# Altium project JDB-001.PrjPcb
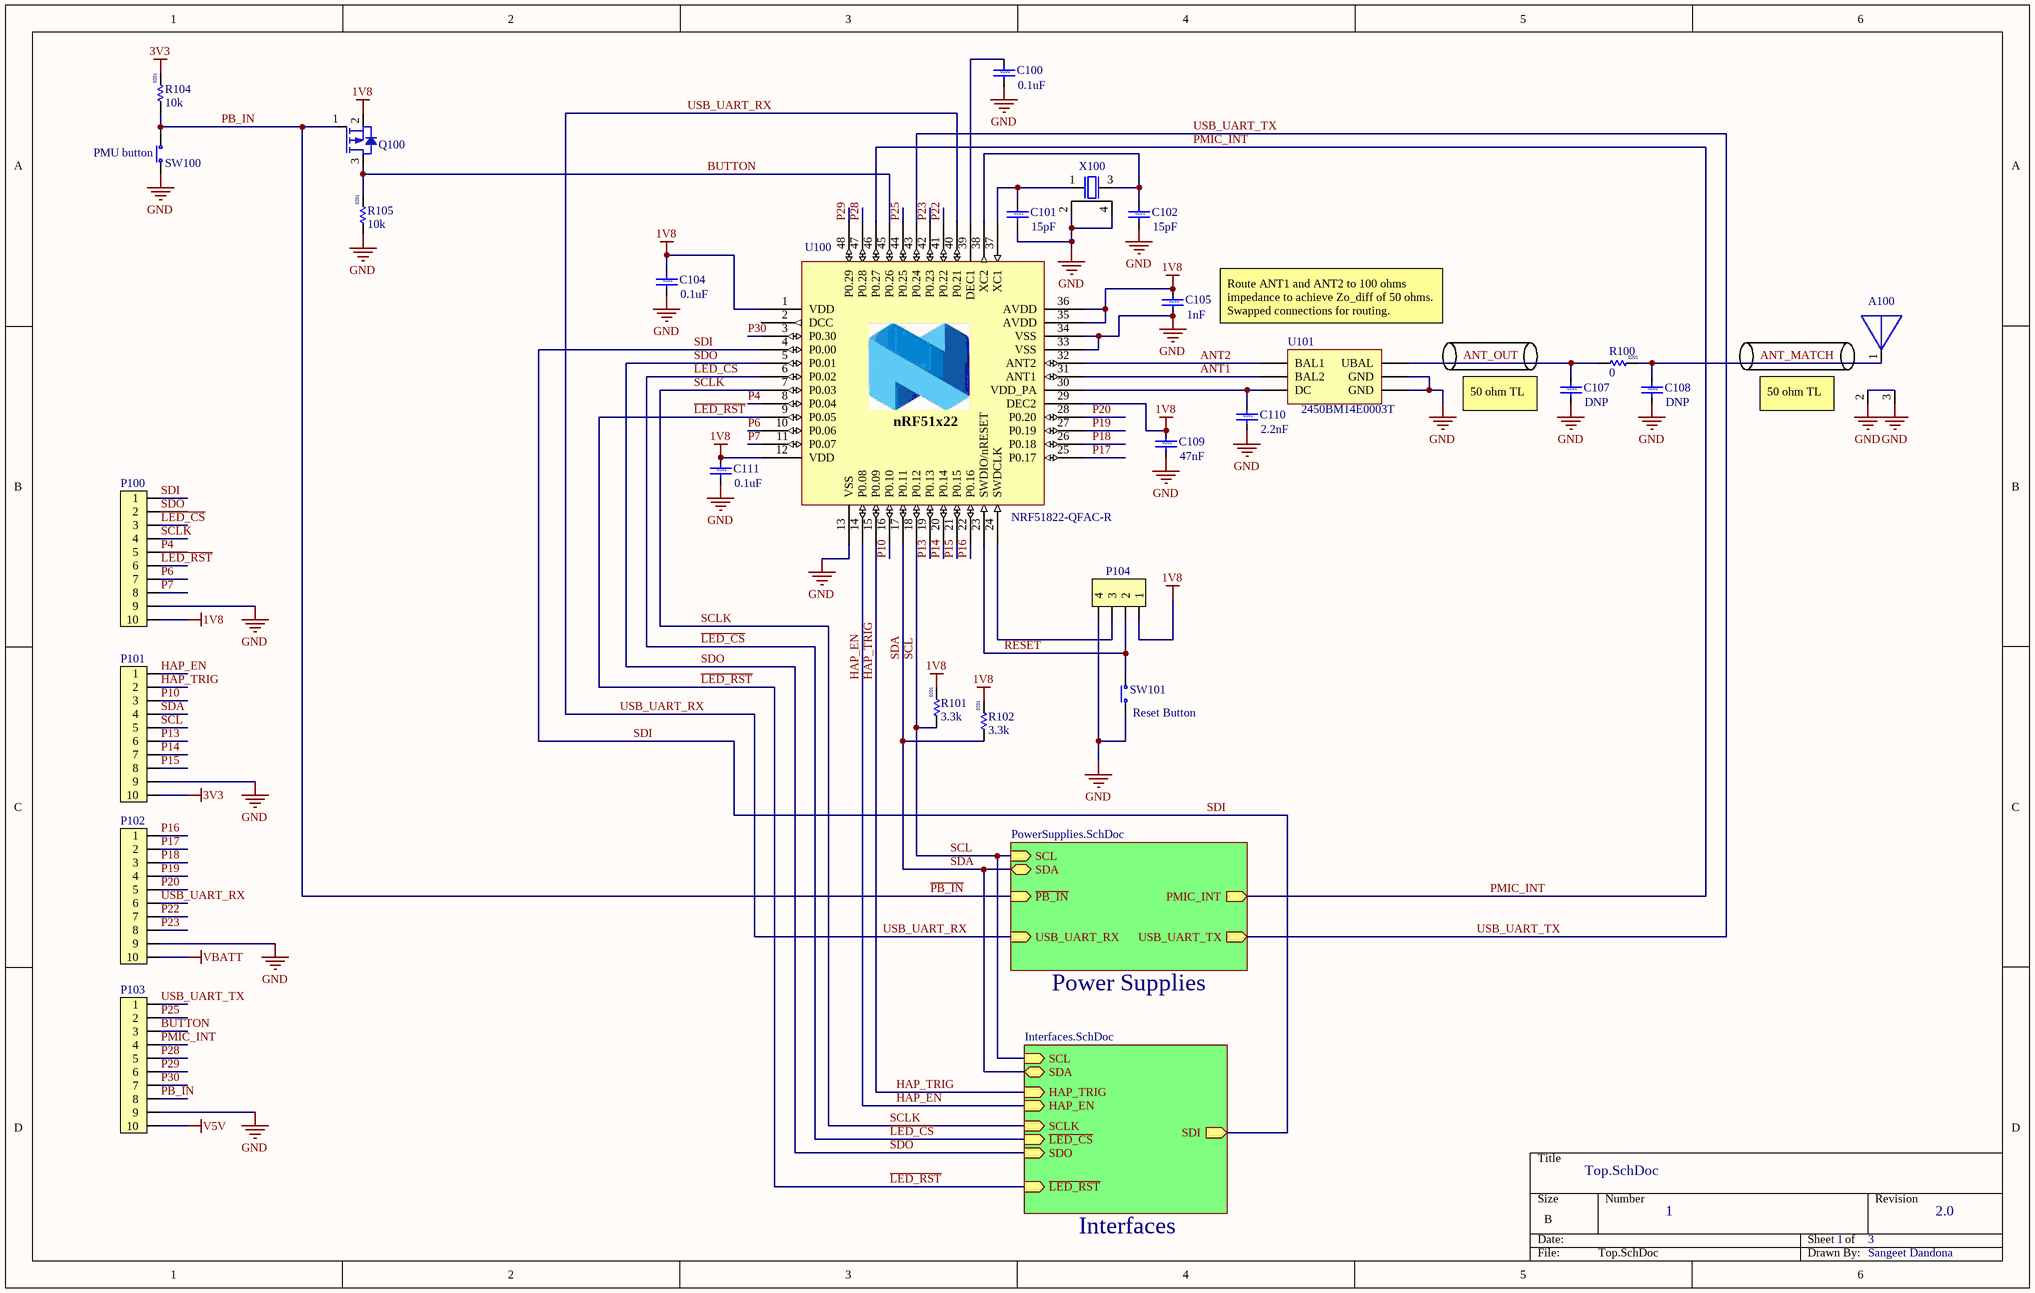
[diagram p0: Top.SchDoc]
3 sheets, 89 parts. Net scope: hierarchical (ports join the sheet entries above them; power ports are global).
Board file: JDB-001.PcbDoc
Sheets:
  Top.SchDoc
    Interfaces = Interfaces.SchDoc
    Power Supplies = PowerSupplies.SchDoc

## Sheet Top.SchDoc
size B; DocumentNumber: 1; SheetNumber: 1; SheetTotal: 3

### Parts
A100  (no value)  [2450AT07A0100]
C100  value 0.1uF  Size: 0201  [Cap 0201 HD]
C101  value 15pF  Size: 0201  [Cap 0201 HD]
C102  value 15pF  Size: 0201  [Cap 0201 HD]
C104  value 0.1uF  Size: 0201  [Cap 0201 HD]
C105  value 1nF  Size: 0201  [Cap 0201 HD]
C107  value DNP  Size: 0201  [Cap 0201 HD]
C108  value DNP  Size: 0201  [Cap 0201 HD]
C109  value 47nF  Size: 0201  [Cap 0201 HD]
C110  value 2.2nF  Size: 0201  [Cap 0201 HD]
C111  value 0.1uF  Size: 0201  [Cap 0201 HD]
P100  (no value)  [Molex 15-91-2100]
P101  (no value)  [Molex 15-91-2100]
P102  (no value)  [Molex 15-91-2100]
P103  (no value)  [Molex 15-91-2100]
P104  (no value)  [4-CONN_MOLEX]
Q100  (no value)  [SOT-723]
R100  value 0  Size: 0201  [RES 0201 HD]
R101  value 3.3k  Size: 0201  [RES 0201 HD]
R102  value 3.3k  Size: 0201  [RES 0201 HD]
R104  value 10k  Size: 0201  [RES 0201 HD]
R105  value 10k  Size: 0201  [RES 0201 HD]
SW100  (no value)  [ALPS_SKHUxxx010_WO_GND]
SW101  (no value)  [ALPS_SKHUxxx010_WO_GND]
U100  NRF51822-QFAC-R  [QFN40P600X600X90-48N]
U101  MFPN: 2450BM14E0003T  [2450BM14E0003]  (hidden comment: nRF51822 Balun RF filter)
X100  (no value)  [XTAL_ABM11-16]

### Sub-sheets
Interfaces = Interfaces.SchDoc: SDA (bidir), SCL (in), SDO (in), ~{LED_CS} (in), ~{LED_RST} (in), SCLK (in), HAP_EN (in), HAP_TRIG (in), SDI (out)
Power Supplies = PowerSupplies.SchDoc: SCL (in), SDA (bidir), PMIC_INT (out), ~{PB_IN} (in), USB_UART_RX (in), USB_UART_TX (out)

### Nets
1V8: C104.1 C105.1 C109.1 C111.1 P100.10 P104.1 Q100.2(S) R101.2 R102.2 U100.1(VDD) U100.12(VDD) U100.29(DEC2) U100.35(AVDD) U100.36(AVDD)
3V3: P101.10 R104.2
GND: A100.2 A100.3 C100.2 C101.2 C102.2 C104.2 C105.2 C107.2 C108.2 C109.2 C110.2 C111.2 P100.9 P101.9 P102.9 P103.9 P104.4 R105.1 SW100.2(COM) SW101.2(COM) U100.13(VSS) U100.33(VSS) U100.34(VSS) U100.49 U101.2(GND) U101.6(GND) X100.2 X100.4
V5V: P103.10
VBATT: P102.10
~{LED_CS}: P100.3 U100.6(P0.02) ; sheet Interfaces/~{LED_CS}
~{LED_RST}: P100.6 U100.9(P0.05) ; sheet Interfaces/~{LED_RST}
~{PB_IN}: P103.8 Q100.1(G) R104.1 SW100.1(N.O) ; sheet Power Supplies/~{PB_IN}  [also labelled PB_IN]
~{RESET}: P104.2 SW101.1(N.O) U100.23(SWDIO/nRESET)
ANT1: U100.31(ANT1) U101.4(BAL2)
ANT2: U100.32(ANT2) U101.3(BAL1)
ANT_MATCH: A100.1 C108.1 R100.2
ANT_OUT: C107.1 R100.1 U101.1(UBAL)
BUTTON: P103.3 Q100.3(D) R105.2 U100.45(P0.26)
HAP_EN: P101.1 U100.14(P0.08) ; sheet Interfaces/HAP_EN
HAP_TRIG: P101.2 U100.15(P0.09) ; sheet Interfaces/HAP_TRIG
P4: P100.5 U100.8(P0.04)
P6: P100.7 U100.10(P0.06)
P7: P100.8 U100.11(P0.07)
P10: P101.3 U100.16(P0.10)
P13: P101.6 U100.19(P0.13)
P14: P101.7 U100.20(P0.14)
P15: P101.8 U100.21(P0.15)
P16: P102.1 U100.22(P0.16)
P17: P102.2 U100.25(P0.17)
P18: P102.3 U100.26(P0.18)
P19: P102.4 U100.27(P0.19)
P20: P102.5 U100.28(P0.20)
P22: P102.7 U100.41(P0.22)
P23: P102.8 U100.42(P0.23)
P25: P103.2 U100.44(P0.25)
P28: P103.5 U100.47(P0.28)
P29: P103.6 U100.48(P0.29)
P30: P103.7 U100.3(P0.30)
PMIC_INT: P103.4 U100.46(P0.27) ; sheet Power Supplies/PMIC_INT
SCL: P101.5 R101.1 U100.18(P0.12) ; sheet Interfaces/SCL, sheet Power Supplies/SCL
SCLK: P100.4 U100.7(P0.03) ; sheet Interfaces/SCLK
SDA: P101.4 R102.1 U100.17(P0.11) ; sheet Interfaces/SDA, sheet Power Supplies/SDA
SDI: P100.1 U100.4(P0.00) ; sheet Interfaces/SDI
SDO: P100.2 U100.5(P0.01) ; sheet Interfaces/SDO
USB_UART_RX: P102.6 U100.40(P0.21) ; sheet Power Supplies/USB_UART_RX
USB_UART_TX: P103.1 U100.43(P0.24) ; sheet Power Supplies/USB_UART_TX
NetC100_1: C100.1 U100.39(DEC1)
NetC101_1: C101.1 U100.37(XC1) X100.1
NetC102_1: C102.1 U100.38(XC2) X100.3
NetC110_1: C110.1 U100.30(VDD_PA) U101.5(DC)
NetP104_3: P104.3 U100.24(SWDCLK)

Not connected (* = marked no-connect by the designer): U100 2(DCC)

### Notes on the sheet
- (near SW100) PMU button
- Route ANT1 and ANT2 to 100 ohms impedance to achieve Zo_diff of 50 ohms. Swapped connections for routing.
- (near C107) 50 ohm TL
- (near A100) 50 ohm TL
- (near SW101) Reset Button
- 2.0
- Sangeet Dandona
- (in symbol nRF51x22_QFAx) nRF51x22

### Library data of the parts
A100 = 2450AT07A0100: ANTENNA SMD EIA 0402 2.4GHZ; MF: Johanson Technology Inc.; MFPN: 2450AT07A0100E; Size: 1mmx0.5mm; Height: 0.37mm; Cost: 0.36562
C100 C104 C111 = Cap 0201 0.1uF 6.3V: CAP CER 0.1UF 6.3V 10% X5R 0201; MF: Murata Electronics North America; MFPN: GRM033R60J104KE19D; Cost: 0.00780
C101 C102 = Cap 0201 11pF 25V: CAP CER 15PF 25V NP0 0201; MF: Murata Electronics North America; MFPN: GRM0335C1E150FA01D; Cost: 0.00900
C105 = Cap 0201 1nF 25V: CAP CER 1000PF 25V 10% X7R 0201; MF: Murata Electronics North America; MFPN: GRM033R71E102KA01D; Cost: 0.00600
C107 C108 = Cap 0201 Generic: Capacitor, Ceramic 0201, DNP; Cost: 0; MF: N/A; MFPN: DNP
C109 = Cap 0201 47nF 10V: CAP CER 0.047UF 10V 10% X5R 0201; MF: Taiyo Yuden; MFPN: LMK063BJ473KP-F; Cost: 0.03000
C110 = Cap 0201 2.2nF 16V: CAP CER 2200PF 16V 10% X7R 0201; MF: Murata Electronics North America; MFPN: GRM033R71C222KA88D; Cost: 0.00630
P100-P103 = CONN-10: CONN HEADER 10POS .100" VERT TIN; MF: Molex, LLC; MFPN: 0015912100; Cost: 0.47152
P104 = CONN-4_MOLEX: CONN HEADER 4POS VERT 2.54MM SMD; MF: Molex, LLC; MFPN: 0878980426; Cost: 0.25300
Q100 = MOSFET-P: MOSFET P-CH 20V 0.1A VMT3; MF: Rohm Semiconductor; MFPN: RZM001P02T2L; Size: 1.2mm x 0.8mm; Package: SOT-723; Cost: 0.22000; Type: MOSFET-P
R100 = Res 0201 0R Jumper: RES SMD 0.0OHM JUMPER 1/20W 0201; MF: Samsung Electro-Mechanics America, Inc.; MFPN: RC0603J000CS; Cost: 0.00787
R101 R102 = Res 0201 3.3k 5%: RES SMD 3.3K OHM 5% 1/20W 0201; MF: Samsung Electro-Mechanics America, Inc.; MFPN: RC0603J332CS; Cost: 0.00648
R104 R105 = Res 0201 10k 5%: RES SMD 10K OHM 5% 1/20W 0201; MF: Rohm Semiconductor; MFPN: MCR006YRTJ103; Cost: 0.00828
SW100 SW101 = SW-PB: Tactile Switches 6.0x6.0x2.5mm 160gf; MF: ALPS; MFPN: SKHUALE010; Cost: 0.201; Size: 6.3mm x 6.2mm x 3.1mm
U100 = nRF51x22_QFAx: IC SOC 2.4GHZ 256K FLASH 48QFN; MF: Nordic Semiconductor ASA; Cost: 2.33310; MFPN: NRF51822-QFAC-R
U101 = nRF51822 Balun RF filter: NORDIC NRF51 BALUN FILTER; MF: Johanson Technology Inc.; Cost: 0.66000
X100 = XTAL_ABM11-16: CRYSTAL 16.0000MHZ 10PF SMD; MF: Abracon LLC; MFPN: ABM11-16.000MHZ-B7G-T; Size: 2.0mm x 1.6mm; Cost: 0.60000

## Sheet Interfaces.SchDoc
size B; DocumentNumber: 2; Revision: 3.0; SheetNumber: 2; SheetTotal: 3
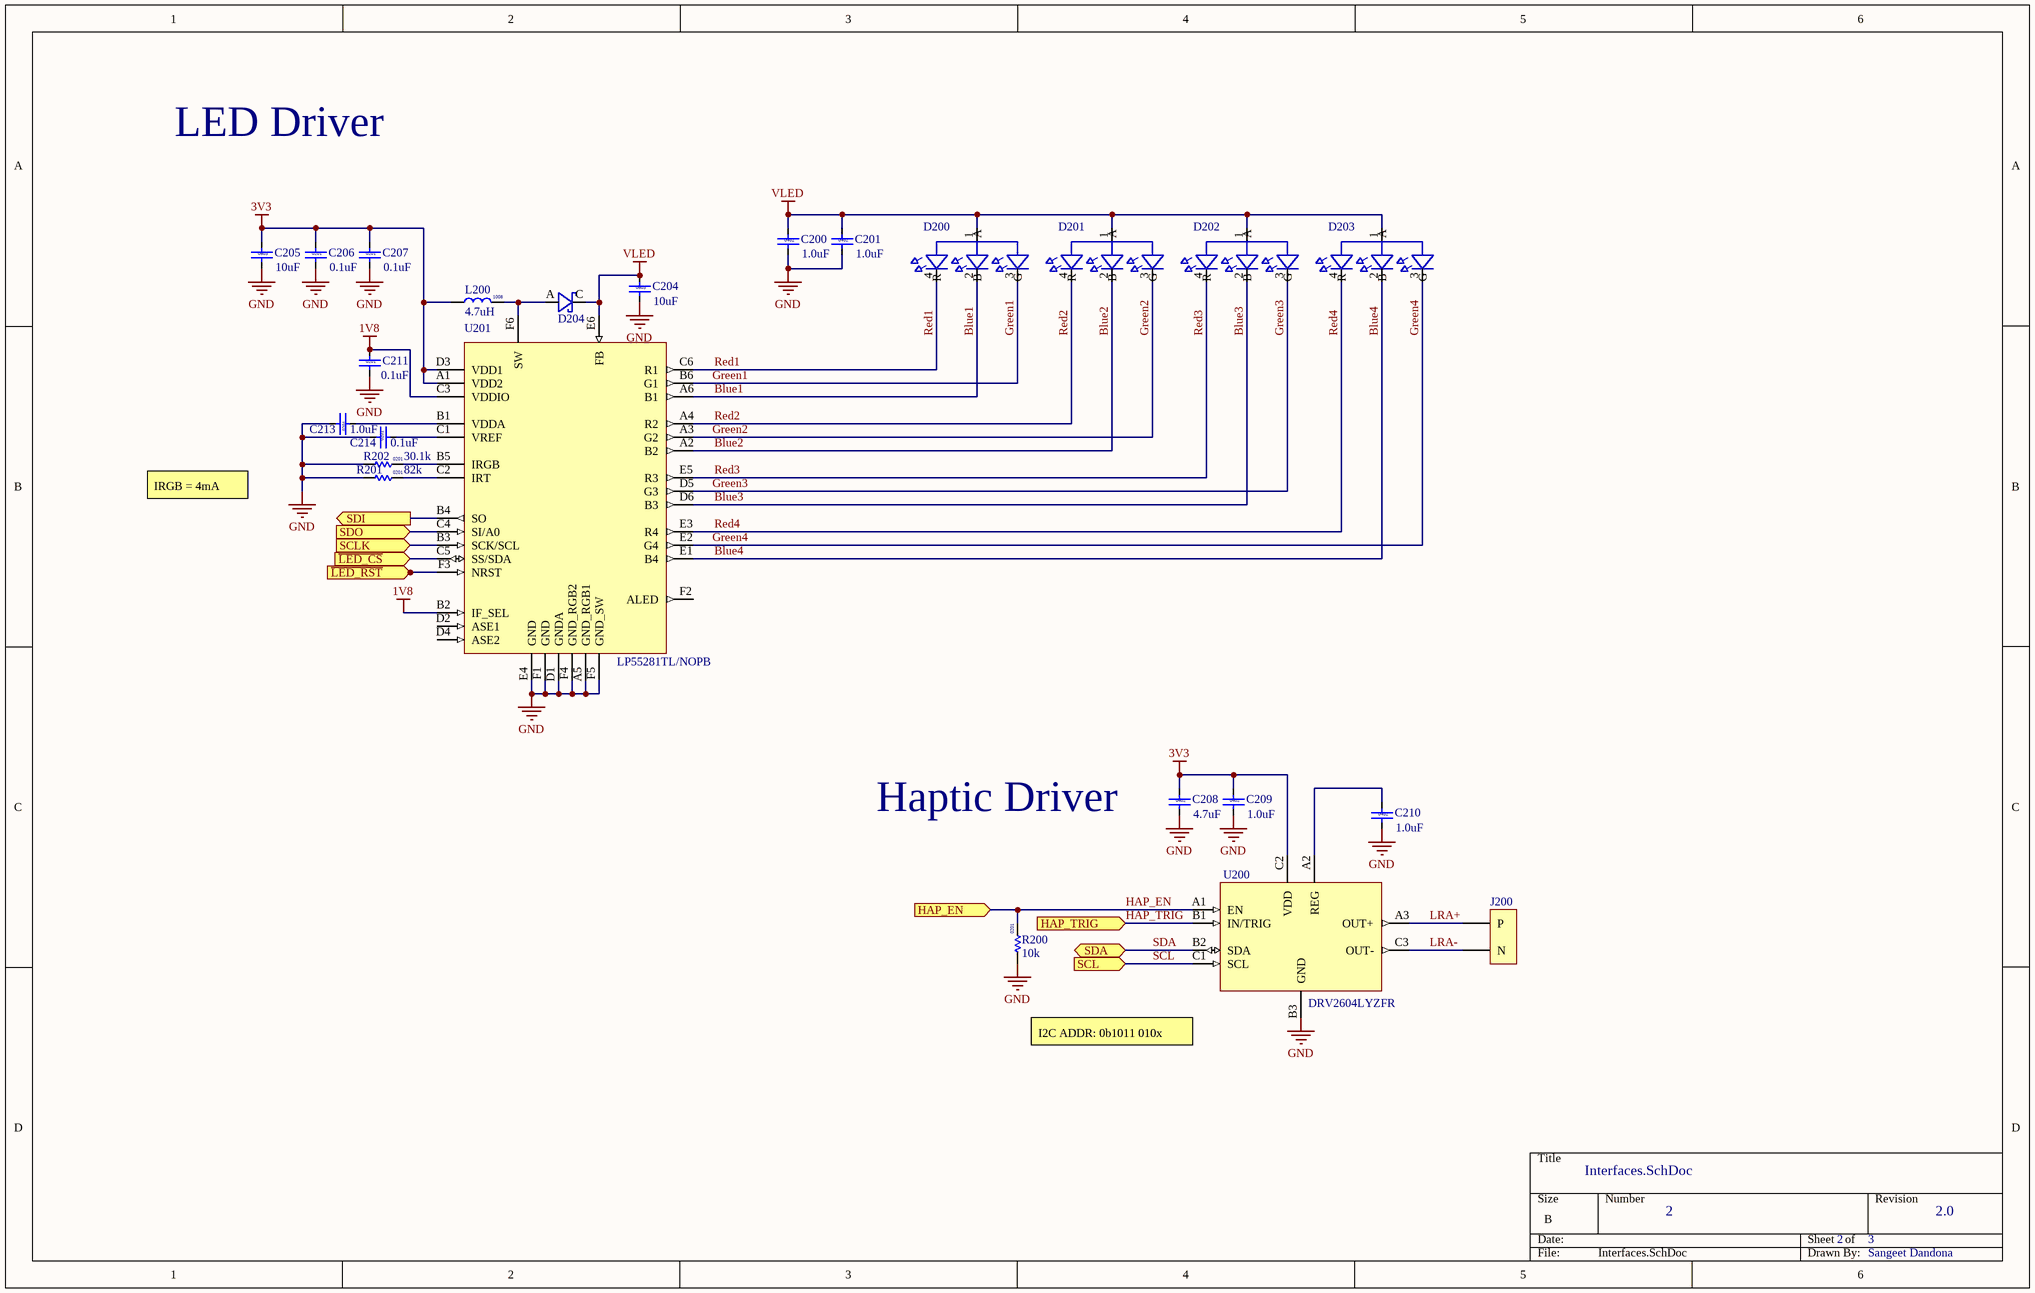
[diagram p1: Interfaces.SchDoc]

### Parts
C200  value 1.0uF  Size: 0402  [Cap 0402 HD]
C201  value 1.0uF  Size: 0402  [Cap 0402 HD]
C204  value 10uF  Size: 0603  [Cap 0603]
C205  value 10uF  Size: 0603  [Cap 0603]
C206  value 0.1uF  Size: 0201  [Cap 0201 HD]
C207  value 0.1uF  Size: 0201  [Cap 0201 HD]
C208  value 4.7uF  Size: 0402  [Cap 0402 HD]
C209  value 1.0uF  Size: 0402  [Cap 0402 HD]
C210  value 1.0uF  Size: 0402  [Cap 0402 HD]
C211  value 0.1uF  Size: 0201  [Cap 0201 HD]
C213  value 1.0uF  Size: 0201  [Cap 0201 HD]
C214  value 0.1uF  Size: 0201  [Cap 0201 HD]
D200  (no value)  [4-PLCC]
D201  (no value)  [4-PLCC]
D202  (no value)  [4-PLCC]
D203  (no value)  [4-PLCC]
D204  (no value)  [SOD-123F_U]
J200  MOLEX_RA_CONN  [MOLEX_RA_CONN]  (value not drawn)
L200  value 4.7uH  Size: 1008  [IND 1008]
R200  value 10k  Size: 0201  [RES 0201 HD]
R201  value 82k  Size: 0201  [RES 0201 HD]
R202  value 30.1k  Size: 0201  [RES 0201 HD]
U200  MFPN: DRV2604LYZFR  [BGA0.5P3x3-9Pin]
U201  MFPN: LP55281TL/NOPB  [BGA0.5P6x6-36Pin]

### Ports
HAP_EN (in), HAP_TRIG (in), SCL (in), SCLK (in), SDA (bidir), SDI (out), SDO (in), ~{LED_CS} (in), ~{LED_RST} (in)

### Nets
1V8: C211.1 U201.B2(IF_SEL) U201.C3(VDDIO)
3V3: C205.1 C206.1 C207.1 C208.1 C209.1 L200.1 U200.C2(VDD) U201.A1(VDD2) U201.D3(VDD1)
GND: C200.2 C201.2 C204.2 C205.2 C206.2 C207.2 C208.2 C209.2 C210.2 C211.2 C213.2 C214.1 R200.1 R201.1 R202.1 U200.B3(GND) U201.A5(GND_RGB1) U201.D1(GNDA) U201.E4(GND) U201.F1(GND) U201.F4(GND_RGB2) U201.F5(GND_SW)
VLED: C200.1 C201.1 C204.1 D200.1(A) D201.1(A) D202.1(A) D203.1(A) D204.C U201.E6(FB)
~{LED_CS}: U201.C5(SS/SDA) ; port ~{LED_CS}
~{LED_RST}: U201.F3(NRST) ; port ~{LED_RST}
Blue1: D200.2(B) U201.A6(B1)
Blue2: D201.2(B) U201.A2(B2)
Blue3: D202.2(B) U201.D6(B3)
Blue4: D203.2(B) U201.E1(B4)
Green1: D200.3(G) U201.B6(G1)
Green2: D201.3(G) U201.A3(G2)
Green3: D202.3(G) U201.D5(G3)
Green4: D203.3(G) U201.E2(G4)
HAP_EN: R200.2 U200.A1(EN) ; port HAP_EN
HAP_TRIG: U200.B1(IN/TRIG) ; port HAP_TRIG
LRA+: J200.1(P) U200.A3(OUT+)
LRA-: J200.2(N) U200.C3(OUT-)
Red1: D200.4(R) U201.C6(R1)
Red2: D201.4(R) U201.A4(R2)
Red3: D202.4(R) U201.E5(R3)
Red4: D203.4(R) U201.E3(R4)
SCL: U200.C1(SCL) ; port SCL
SCLK: U201.B3(SCK/SCL) ; port SCLK
SDA: U200.B2(SDA) ; port SDA
SDI: U201.B4(SO) ; port SDI
SDO: U201.C4(SI/A0) ; port SDO
NetC210_1: C210.1 U200.A2(REG)
NetC213_1: C213.1 U201.B1(VDDA)
NetC214_2: C214.2 U201.C1(VREF)
NetD204_A: D204.A L200.2 U201.F6(SW)
NetR201_2: R201.2 U201.C2(IRT)
NetR202_2: R202.2 U201.B5(IRGB)

Not connected (* = marked no-connect by the designer): U201 D2(ASE1) D4(ASE2) F2(ALED)

### Notes on the sheet
- LED Driver
- IRGB = 4mA
- (near C208) Haptic Driver
- (near U200) I2C ADDR: 0b1011 010x
- 2.0
- Sangeet Dandona

### Library data of the parts
C200 C201 C209 = Cap 0402 1.0uF 10V: CAP CER 1UF 10V 10% X5R 0402; MF: Murata Electronics North America; MFPN: GRM155R61A105KE15D; Cost: 0.00990
C204 C205 = Cap 0603 10uF 10V: CAP CER 10UF 10V 20% X5R 0603; MF: TDK Corporation; MFPN: C1608X5R1A106M080AC; Cost: 0.12650
C206 C207 C211 C214 = Cap 0201 0.1uF 6.3V: as C100 on sheet Top; Cost: 0.00780
C208 = Cap 0402 4.7uF 10V: CAP CER 4.7UF 10V 20% X5R 0402; MF: Samsung Electro-Mechanics America, Inc.; MFPN: CL05A475MP5NRNC; Cost: 0.11730
C210 = Cap 0402 1.0uF 10V: CAP CER 1UF 10V 10% X5R 0402; MFPN: GRM155R61A105KE15D; MF: Murata Electronics North America; Cost: 0.00990
C213 = Cap 0201 1.0uF 6.3V: CAP CER 1UF 6.3V 20% X5R 0201; MF: Samsung Electro-Mechanics America, Inc.; MFPN: CL03A105MQ3CSNC; Cost: 0.27950
D200-D203 = CLMVB-FKA-CFHEHLCBB7A363: LED RGB 3-IN-1 SMD 4PLCC; MF: Cree Inc.; Size: 2.1mm x 2.1mm; Package: 4-PLCC; Cost: 2.68; MFPN: CLMVB-FKA-CFHEHLCBB7A363
D204 = MBR120VLSFT3G: DIODE SCHOTTKY 20V 1A SOD123FL; MF: ON Semiconductor; Size: 3.8mm x 1.8mm; Package: SOD-123F; Type: Schottky; Cost: 0.11660; MFPN: MBR120VLSFT3G
J200 = MOLEX_RA_CONN: CONN HEADER 2POS 1.25MM R/A SMD; MF: Molex, LLC; Pitch: 0.049" (1.25mm); MFPN: 0537800270; Cost: 1.23900
L200 = Ind 1008 4.7uH 650mA: FIXED IND 4.7UH 1A 250 MOHM SMD; MF: Samsung Electro-Mechanics America, Inc.; MFPN: CIG22B4R7MNE; Cost: 0.08498
R200 = Res 0201 10k 5%: as R104 on sheet Top; Cost: 0.00828
R201 = Res 0201 Generic: RES SMD 82K OHM 1% 1/20W 0201; MF: Panasonic Electronic Components; MFPN: ERJ-1GEF8202C; Cost: 0.01049
R202 = Res 0201 Generic: RES SMD 30.1K OHM 1% 1/20W 0201; MF: Panasonic Electronic Components; MFPN: ERJ-1GEF3012C; Cost: 0.01049
U200 = DRV2604L: IC ERM/LRA HAPTIC DRIVER 9DSBGA; MF: Texas Instruments; Size: 1.47mm x 1.47mm; Cost: 1.35000
U201 = LP55281TL: IC LED DRIVER RGLTR DIM 36USMD; MF: Texas Instruments; Size: 3.013mm x 3.013mm; Cost: 1.17000

## Sheet PowerSupplies.SchDoc
size B; DocumentNumber: 3; Revision: 3.0; SheetNumber: 3; SheetTotal: 3
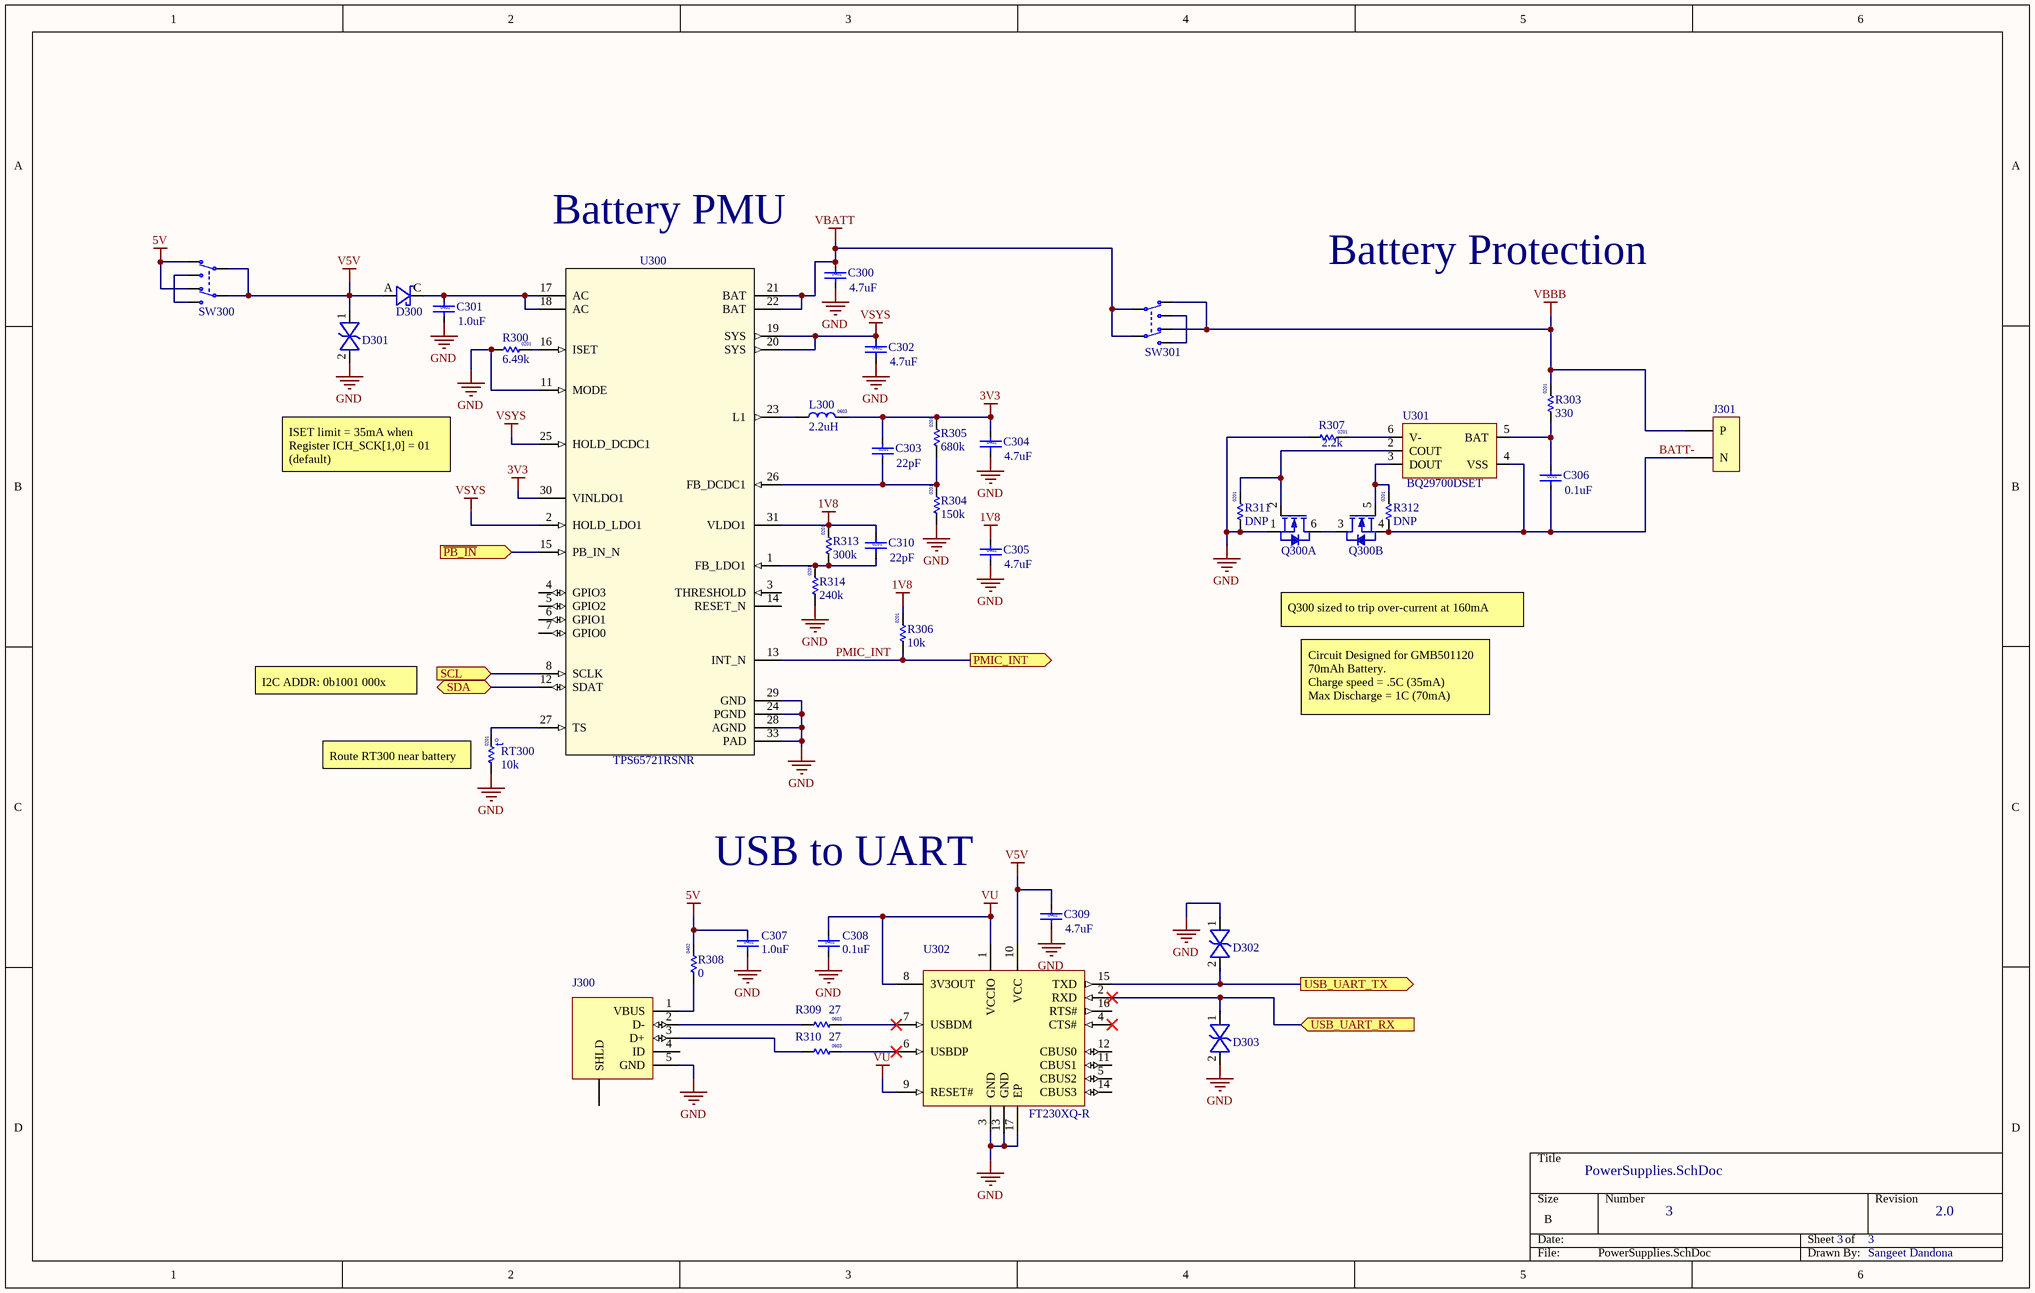
[diagram p2: PowerSupplies.SchDoc]

### Parts
C300  value 4.7uF  Size: 0402  [Cap 0402 HD]
C301  value 1.0uF  Size: 0402  [Cap 0402 HD]
C302  value 4.7uF  Size: 0402  [Cap 0402 HD]
C303  value 22pF  Size: 0201  [Cap 0201 HD]
C304  value 4.7uF  Size: 0402  [Cap 0402 HD]
C305  value 4.7uF  Size: 0402  [Cap 0402 HD]
C306  value 0.1uF  Size: 0201  [Cap 0201 HD]
C307  value 1.0uF  Size: 0402  [Cap 0402 HD]
C308  value 0.1uF  Size: 0402  [Cap 0402 HD]
C309  value 4.7uF  Size: 0402  [Cap 0402 HD]
C310  value 22pF  Size: 0201  [Cap 0201 HD]
D300  (no value)  [Diode 0603 HD]
D301  (no value)  [CAP 0402 HD]
D302  (no value)  [CAP 0402 HD]
D303  (no value)  [CAP 0402 HD]
J300  (no value)  [USB_Micro_RA_W-TABS]
J301  MOLEX_RA_CONN  [MOLEX_RA_CONN]  (value not drawn)
L300  value 2.2uH  Size: 0603  [IND 0603]
Q300  (no value)  [SC70-6]  (parts A,B of 2)
R300  value 6.49k  Size: 0201  [RES 0201 HD]
R303  value 330  Size: 0201  [RES 0201 HD]
R304  value 150k  Size: 0201  [RES 0201 HD]
R305  value 680k  Size: 0201  [RES 0201 HD]
R306  value 10k  Size: 0201  [RES 0201 HD]
R307  value 2.2k  Size: 0201  [RES 0201 HD]
R308  value 0  Size: 0402  [RES 0402]
R309  value 27  Size: 0603  [RES 0603 HD]
R310  value 27  Size: 0603  [RES 0603 HD]
R311  value DNP  Size: 0201  [RES 0201 HD]
R312  value DNP  Size: 0201  [RES 0201 HD]
R313  value 300k  Size: 0201  [RES 0201 HD]
R314  value 240k  Size: 0201  [RES 0201 HD]
RT300  value 10k  Size: 0201  [RES 0201 HD]  (hidden comment: Res Thermal)
SW300  (no value)  [JS202011SCQN]
SW301  (no value)  [JS202011SCQN]
U300  TPS65721RSNR  [32-QFN (4x4)]
U301  MFPN: BQ29700DSET  [SON0.5P-6Pin]
U302  MFPN: FT230XQ-R  [QFN0.65P4x4-16Pin_W-Pad]

### Ports
PMIC_INT (out), SCL (in), SDA (bidir), USB_UART_RX (in), USB_UART_TX (out), ~{PB_IN} (in)

### Nets
1V8: C305.1 C310.1 R306.2 R313.2 U300.31(VLDO1)
3V3: C303.1 C304.1 L300.2 R305.2 U300.30(VINLDO1)
5V: C307.1 R308.2 SW300.3(N.C-1) SW300.6(N.C-2)
GND: C300.2 C301.2 C302.2 C304.2 C305.2 C307.2 C308.2 C309.2 D301.2 D302.1 D303.2 J300.5(GND) Q300.1(S1) R300.1 R304.1 R307.1 R311.1 R314.1 RT300.2 U300.11(MODE) U300.24(PGND) U300.28(AGND) U300.29(GND) U300.33(PAD) U302.3(GND) U302.13(GND) U302.17(EP)
V5V: C309.1 D300.A D301.1 SW300.2(COM-1) SW300.5(COM-2) U302.10(VCC)
VBATT: C300.1 SW301.2(COM-1) SW301.5(COM-2) U300.21(BAT) U300.22(BAT)
VBBB: J301.1(P) R303.2 SW301.3(N.C-1) SW301.6(N.C-2)
VSYS: C302.1 U300.2(HOLD_LDO1) U300.19(SYS) U300.20(SYS) U300.25(HOLD_DCDC1)
VU: C308.1 U302.1(VCCIO) U302.8(3V3OUT) U302.9(RESET#)
~{PB_IN}: U300.15(PB_IN_N) ; port ~{PB_IN}
BATT-: C306.2 J301.2(N) Q300.4(S2) R312.1 U301.4(VSS)
PMIC_INT: R306.1 U300.13(INT_N) ; port PMIC_INT
SCL: U300.8(SCLK) ; port SCL
SDA: U300.12(SDAT) ; port SDA
USB_UART_RX: D303.1 U302.2(RXD) ; port USB_UART_RX
USB_UART_TX: D302.2 U302.15(TXD) ; port USB_UART_TX
NetC301_1: C301.1 D300.C U300.17(AC) U300.18(AC)
NetC303_2: C303.2 R304.2 R305.1 U300.26(FB_DCDC1)
NetC306_1: C306.1 R303.1 U301.5(BAT)
NetC310_2: C310.2 R313.1 R314.2 U300.1(FB_LDO1)
NetJ300_1: J300.1(VBUS) R308.1
NetJ300_2: J300.2(D-) R309.1
NetJ300_3: J300.3(D+) R310.1
NetL300_1: L300.1 U300.23(L1)
NetQ300_2: Q300.2(G1) R311.2 U301.2(COUT)
NetQ300_3: Q300.3(D2) Q300.6(D1)
NetQ300_5: Q300.5(G2) R312.2 U301.3(DOUT)
NetR300_2: R300.2 U300.16(ISET)
NetR307_2: R307.2 U301.6(V-)
NetR309_2: R309.2 U302.7(USBDM)
NetR310_2: R310.2 U302.6(USBDP)
NetRT300_1: RT300.1 U300.27(TS)
NetSW300_1: SW300.1(N.O-1) SW300.4(N.O-2)
NetSW301_1: SW301.1(N.O-1) SW301.4(N.O-2)

Not connected (* = marked no-connect by the designer): J300 4(ID) 6(SHLD); U300 3(THRESHOLD) 4(GPIO3) 5(GPIO2) 6(GPIO1) 7(GPIO0) 14(RESET_N); U301 1(NC); U302 4(CTS#)* 5(CBUS2) 11(CBUS1) 12(CBUS0) 14(CBUS3) 16(RTS#)

### Notes on the sheet
- Battery PMU
- Battery Protection
- ISET limit = 35mA when
  Register ICH_SCK[1,0] = 01
  (default)
- Q300 sized to trip over-current at 160mA
- I2C ADDR: 0b1001 000x
- (near RT300) Route RT300 near battery
- Circuit Designed for GMB501120
  70mAh Battery.
  Charge speed = .5C (35mA)
  Max Discharge = 1C (70mA)
- USB to UART
- 2.0
- Sangeet Dandona
- (in symbol Therm 0201 10k NTC) t°

### Library data of the parts
C300 C302 C304 C305 C309 = Cap 0402 4.7uF 10V: as C208 on sheet Interfaces; Cost: 0.11730
C301 C307 = Cap 0402 1.0uF 10V: as C200 on sheet Interfaces; Cost: 0.00990
C303 C310 = Cap 0201 22pF 50V: CAP CER 22PF 50V 5% NP0 0201; MF: Murata Electronics North America; MFPN: GRM0335C1H220JA01D; Cost: 0.00570
C306 = Cap 0201 0.1uF 6.3V: as C100 on sheet Top; Cost: 0.00780
C308 = Cap 0402 0.1uF 10V: CAP CER 0.1UF 10V 10% X5R 0402; MFPN: GRM155R61A104KA01J; MF: Murata Electronics North America; Cost: 0.00300
D300 = CDBU05x0: DIODE SCHOTTKY 20V 500MA 0603; MF: Comchip Technology; MFPN: CDBU0520; Size: 1.8mm x 1.0mm; Type: Schottky; Cost: 0.09888
D301-D303 = SESD0402P1BN-0450-090: TVS DIODE 6VWM 12VC 0402; MF: TE Connectivity Raychem Circuit Protection; Size: 1.1mm x 0.5mm; Cost: 0.11000; MFPN: SESD0402P1BN-0450-090; Type: TVS
J300 = USB_Micro_B_W-Tabs: CONN USB MICRO B RECPT SMT R/A; MF: FCI; MFPN: 10118194-0001LF; Size: 8mm x 5mm; Cost: 0.18000
J301 = MOLEX_RA_CONN: as J200 on sheet Interfaces; Cost: 1.23900
L300 = Ind 0603 2.2uH 160mA: FIXED IND 2.2UH 600MA 170 MOHM; MFPN: GLFR1608T2R2M-LR; MF: TDK Corporation; Cost: 0.12190
Q300 = Si1902CDL: MOSFET 2N-CH 20V 1.1A SC-70-6; Type: N-MOSFET; MF: Vishay Siliconix; MFPN: SI1902CDL-T1-GE3; Size: 2.4mm x 2.2mm; Cost: 0.12210
R300 = Res 0201 Generic: RES SMD 6.49K OHM 1% 1/20W 0201; MF: Panasonic Electronic Components; MFPN: ERJ-1GEF6491C; Cost: 0.10000
R303 = Res 0201 330R 5%: RES SMD 330 OHM 5% 1/20W 0201; MFPN: MCR006YRTJ331; MF: Rohm Semiconductor; Cost: 0.00834
R304 = Res 0201 150k 1%: RES SMD 150K OHM 1% 1/20W 0201; MF: Rohm Semiconductor; MFPN: MCR006YRTF1503; Cost: 0.01102
R305 = Res 0201 301k 1%: RES SMD 680K OHM 1% 1/20W 0201; MF: Panasonic Electronic Components; MFPN: ERJ-1GEF6803C; Cost: 0.01049
R306 = Res 0201 10k 5%: RES SMD 10K OHM 5% 1/20W 0201; MFPN: MCR006YRTJ103; MF: Rohm Semiconductor; Cost: 0.00828
R307 = Res 0201 2.2k 5%: RES SMD 2.2K OHM 5% 1/20W 0201; MF: Panasonic Electronic Components; MFPN: ERJ-1GEJ222C; Cost: 0.00787
R308 = Res 0402 0R Jumper: RES SMD 0.0OHM JUMPER 1/16W 0402; MF: Samsung Electro-Mechanics America, Inc.; MFPN: RC1005J000CS; Cost: 0.00198
R309 R310 = Res 0603 27R 5%: RES SMD 27 OHM 5% 1/10W 0603; MF: Rohm Semiconductor; MFPN: MCR03ERTJ270; Cost: 0.00338
R311 R312 = Res 0201 Generic: Resistor, 0201, DNP; Cost: 0; MF: N/A; MFPN: DNP
R313 = Res 0201 301k 1%: RES SMD 300K OHM 1% 1/20W 0201; MF: Panasonic Electronic Components; MFPN: ERJ-1GEF3003C; Cost: 0.10000
R314 = Res 0201 150k 1%: RES SMD 240K OHM 1% 1/20W 0201; MF: Panasonic Electronic Components; MFPN: ERJ-1GEF2403C; Cost: 0.10000
RT300 = Therm 0201 10k NTC: THERMISTOR 10K OHM NTC 0201 SMD; MF: Murata Electronics North America; MFPN: NCP03XH103J05RL; Cost: 0.08514
SW300 SW301 = SW-DPDT: SWITCH SLIDE DPDT 300MA 6V; MF: C&K Components; Cost: 0.46200; MFPN: JS202011SCQN
U300 = TPS65721: IC PMU 2CH CONV/LDO 32QFN; MF: Texas Instruments; Application_BuildNumber: *; Cost: 2.44600; MFPN: TPS65721RSNR
U301 = BQ29700: IC LITHIUM BATT PROTECT 6-SON; MFG Footprint: DSE (S-PWSON-N6); MF: Texas Instruments; Size: 1.55mm x 1.55mm; Cost: 0.67800
U302 = FT230XQ: IC USB SERIAL BASIC UART 16QFN; MF: FTDI, Future Technology Devices International Ltd; Height: .8mm; Size: 4.1mm x 4.1mm; Cost: 1.52950

## Nets that join several sheets
1V8: Top (14 pins), Interfaces (C211.1 U201.B2 U201.C3), PowerSupplies (5 pins)
3V3: Top (P101.10 R104.2), Interfaces (9 pins), PowerSupplies (5 pins)
GND: Top (28 pins), Interfaces (22 pins), PowerSupplies (27 pins)
V5V: Top (P103.10), PowerSupplies (6 pins)
VBATT: Top (P102.10), PowerSupplies (5 pins)
~{LED_CS}: Top (P100.3 U100.6), Interfaces (U201.C5)
~{LED_RST}: Top (P100.6 U100.9), Interfaces (U201.F3)
~{PB_IN}: Top (P103.8 Q100.1 R104.1 SW100.1), PowerSupplies (U300.15)
HAP_EN: Top (P101.1 U100.14), Interfaces (R200.2 U200.A1)
HAP_TRIG: Top (P101.2 U100.15), Interfaces (U200.B1)
PMIC_INT: Top (P103.4 U100.46), PowerSupplies (R306.1 U300.13)
SCL: Top (P101.5 R101.1 U100.18), Interfaces (U200.C1), PowerSupplies (U300.8)
SCLK: Top (P100.4 U100.7), Interfaces (U201.B3)
SDA: Top (P101.4 R102.1 U100.17), Interfaces (U200.B2), PowerSupplies (U300.12)
SDI: Top (P100.1 U100.4), Interfaces (U201.B4)
SDO: Top (P100.2 U100.5), Interfaces (U201.C4)
USB_UART_RX: Top (P102.6 U100.40), PowerSupplies (D303.1 U302.2)
USB_UART_TX: Top (P103.1 U100.43), PowerSupplies (D302.2 U302.15)